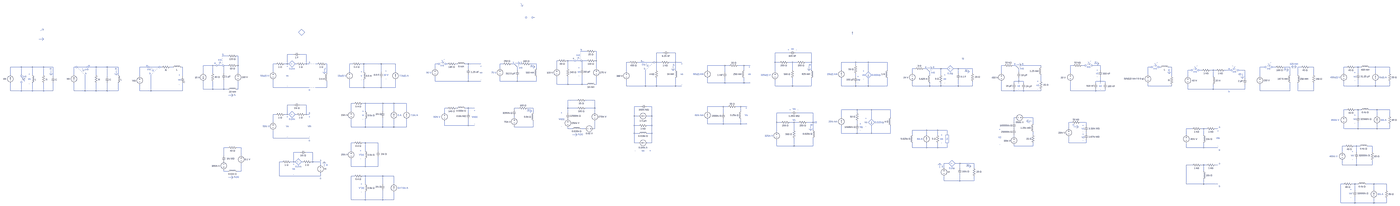
[diagram p0: schematic ELE226-3.asc, whole sheet]
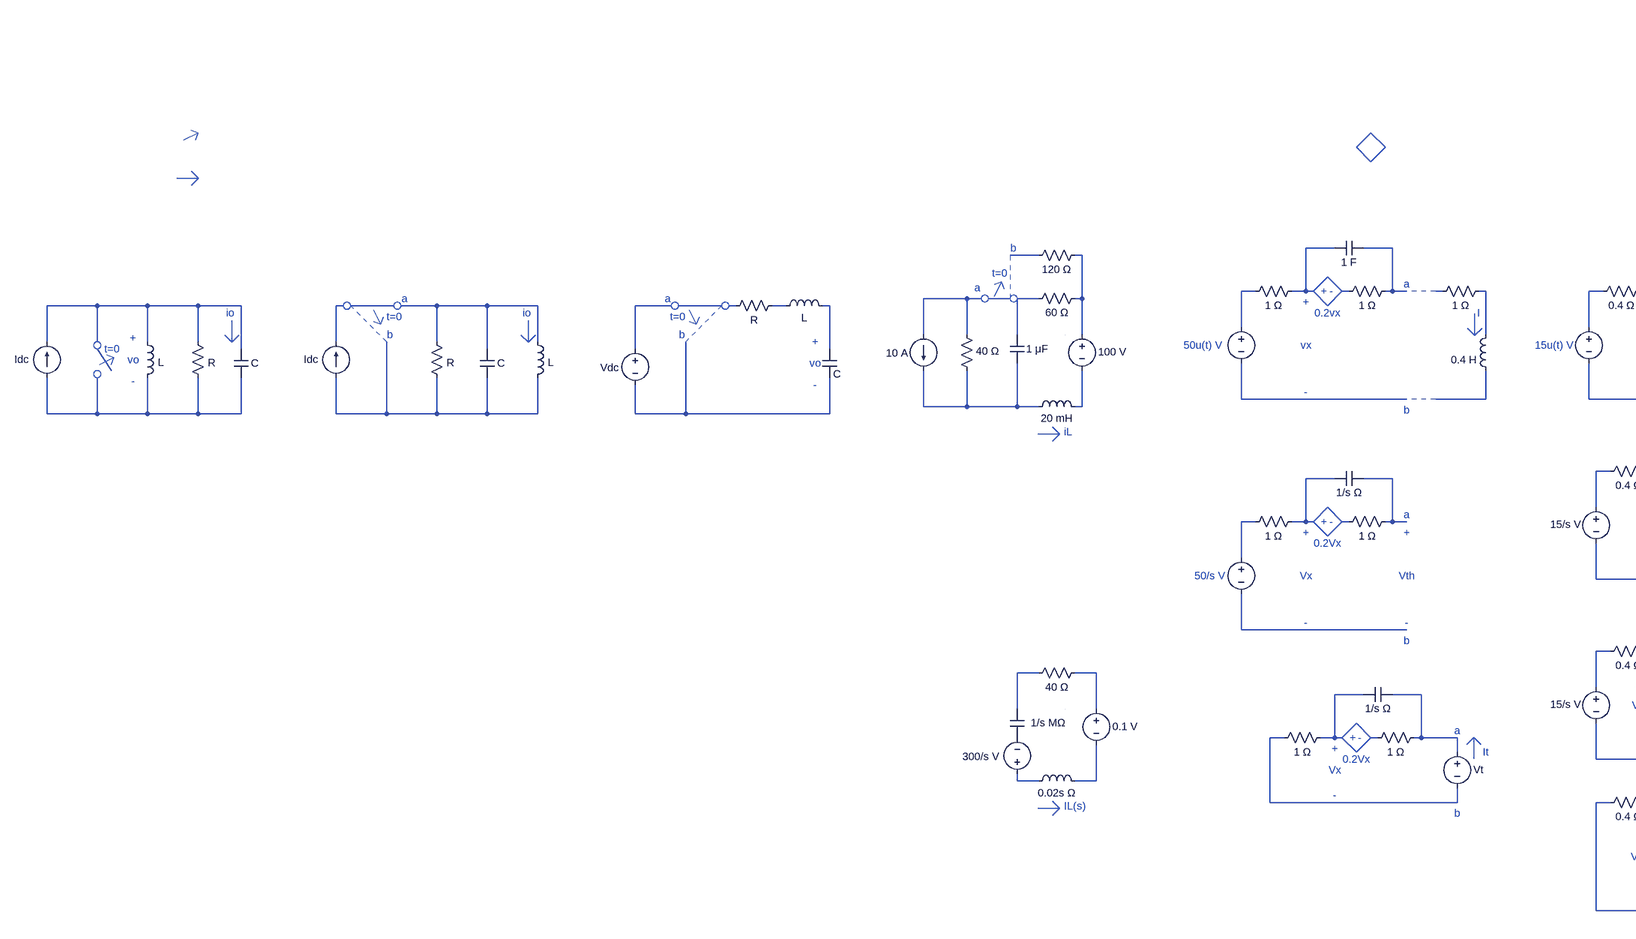
[diagram p1: schematic ELE226-3.asc, part, row 1 of 1, column 1 of 4]
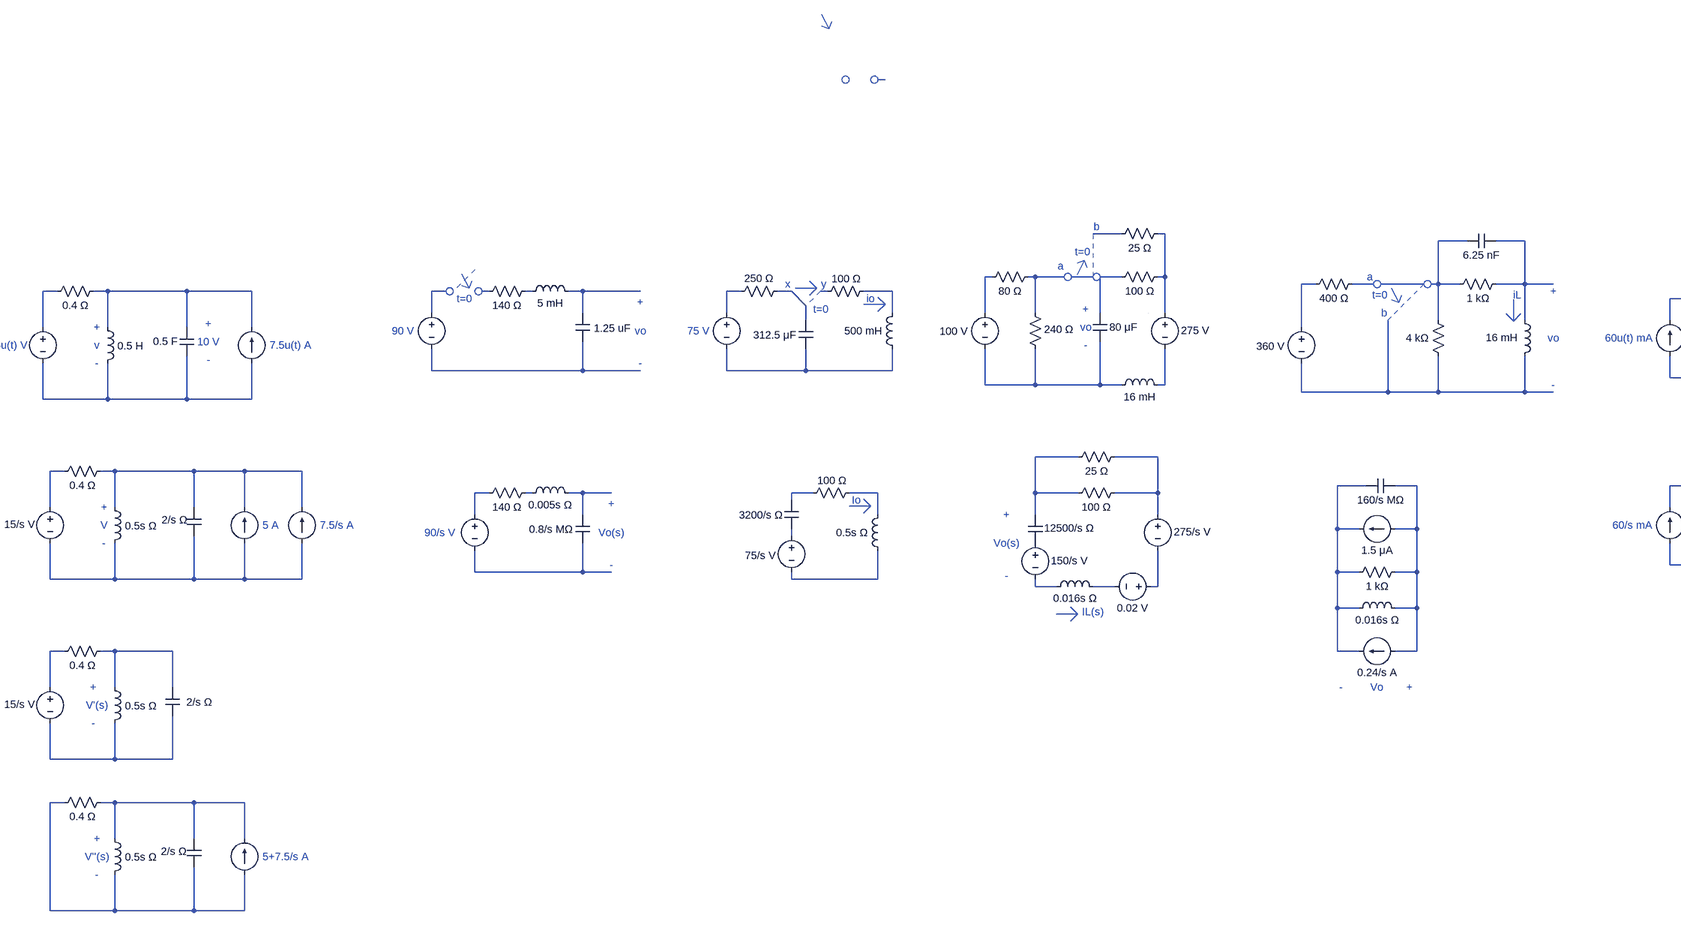
[diagram p2: schematic ELE226-3.asc, part, row 1 of 1, column 2 of 4]
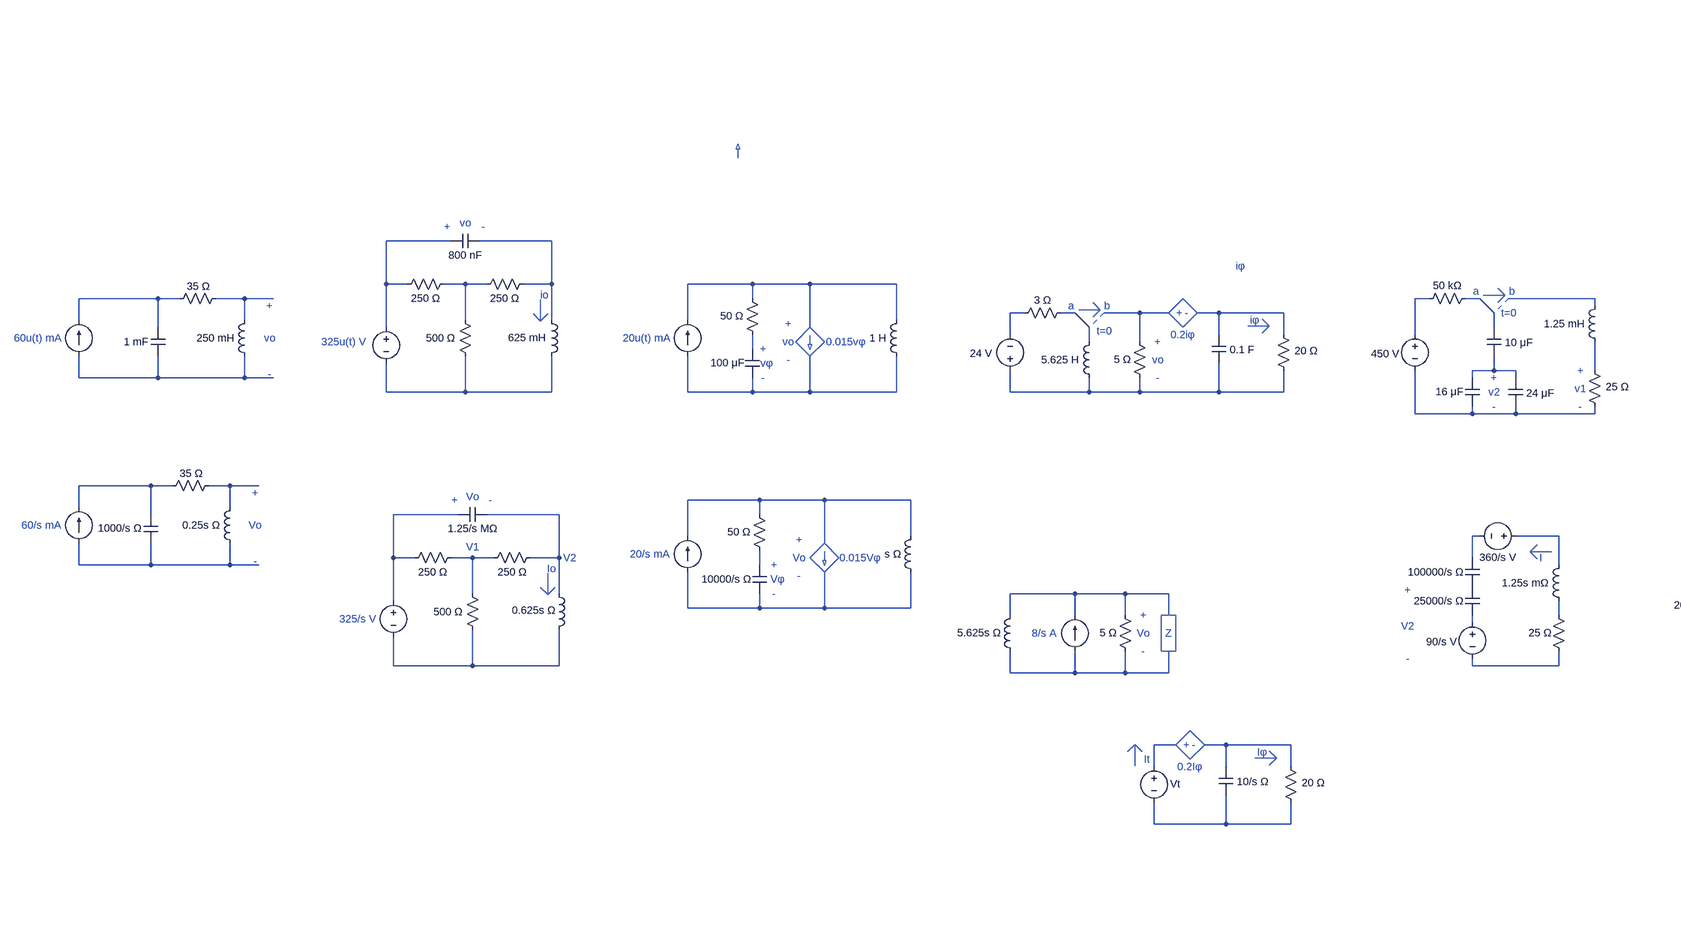
[diagram p3: schematic ELE226-3.asc, part, row 1 of 1, column 3 of 4]
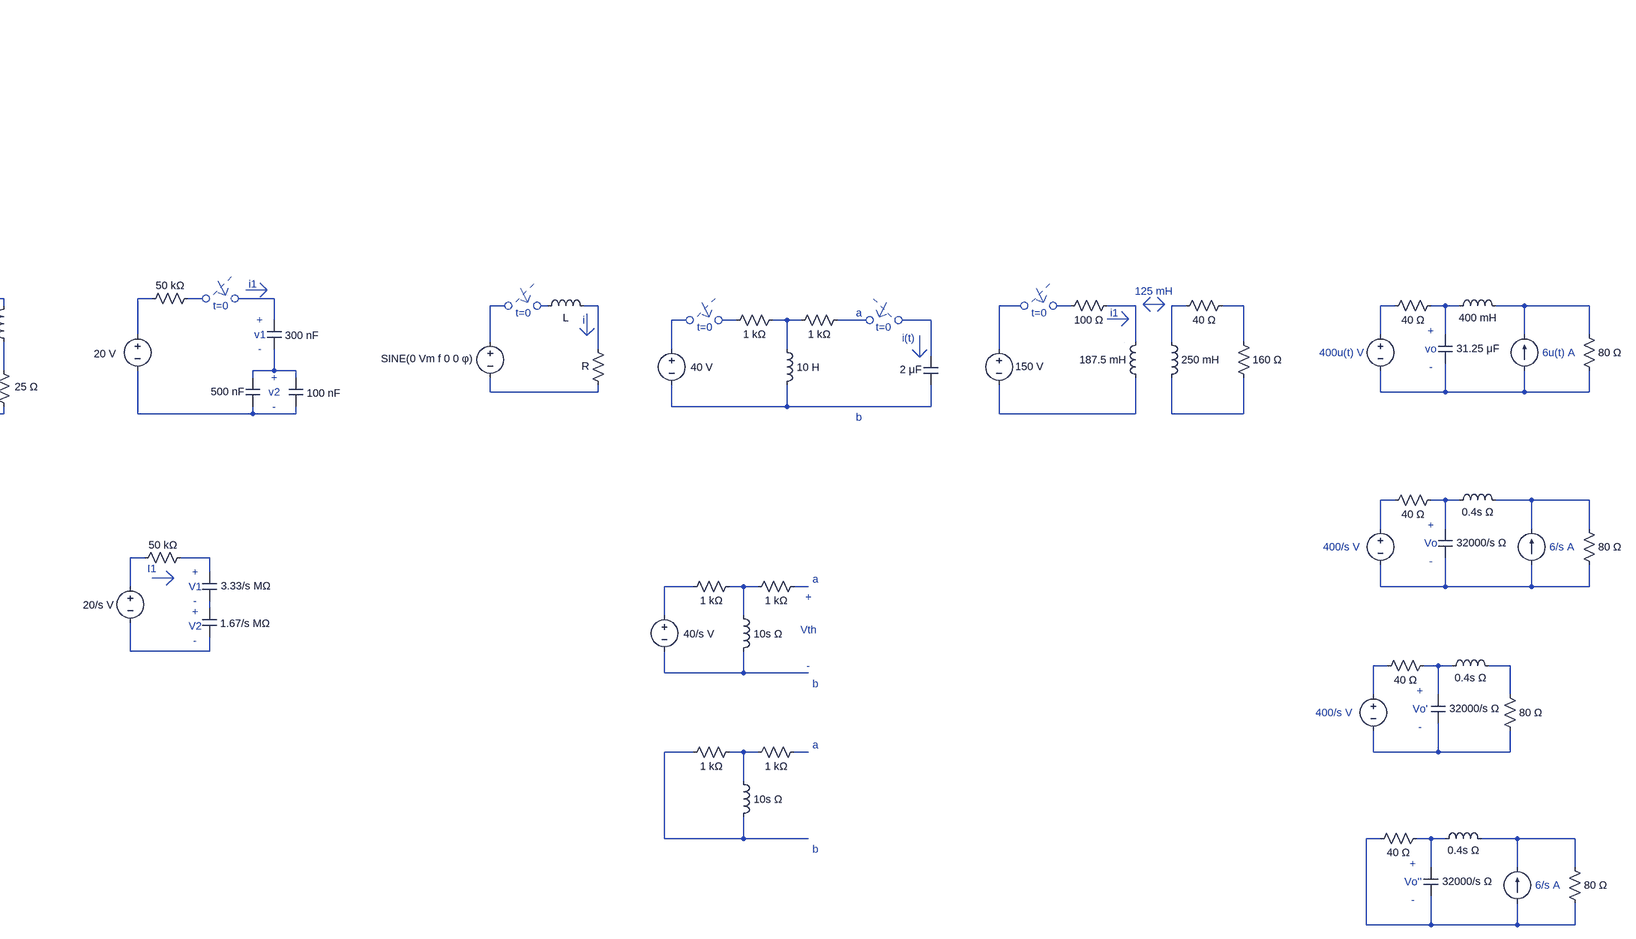
[diagram p4: schematic ELE226-3.asc, part, row 1 of 1, column 4 of 4]
* ELE226-3.asc
I1 N097 N046 Idc
L1 N046 N097 L
R1 N046 N097 R
C1 N046 N097 C
I2 N098 N047 Idc
L2 N049 N098 L
R2 N049 N098 R
C2 N049 N098 C
V1 N050 N099 Vdc
R3 N053 N052 R
L3 N053 N054 L
C3 N054 N099 C
I3 N035 N094 10 A
R5 N035 N094 40 Ω
C5 N094 N037 1 μF
R6 N011 N010 120 Ω
R7 N011 N037 60 Ω
V2 N011 N095 100 V
L4 N094 N095 20 mH
V3 N021 N091 50\u(t)
R4 N008 N021 1 Ω
C6 N008 N009 1 F
R8 N009 N022 1 Ω
R9 N024 N023 1 Ω
L5 N092 N024 0.4 H
V4 N025 N093 50\u(t)
R10 N026 N025 0.4 Ω
C4 N026 N093 0.5 F
L6 N026 N093 0.5 H
I4 N093 N026 Idc
V5 N027 N077 50\u(t)
R11 N029 N028 140 Ω
C7 N030 N077 1.25 uF
L7 N029 N030 5 mH
V6 N031 N078 50\u(t)
R12 N032 N031 250 Ω
L8 N078 N034 500 mH
C9 N032 N078 312.5 μF
R13 N033 N034 100 Ω
R16 N013 N083 240 Ω
C10 N083 N015 80 μF
R17 N003 N002 25 Ω
R18 N003 N015 100 Ω
V8 N003 N084 275 V
L10 N083 N084 16 mH
V7 N012 N083 100 V
R14 N013 N012 80 Ω
V11 N016 N085 360 V
C11 N005 N004 6.25 nF
R15 N017 N016 400 Ω
R19 N085 N004 4 kΩ
R20 N004 N005 1 kΩ
L9 N005 N085 16 mH
L11 N082 N039 250 mH
C8 N038 N082 1 mF
R22 N038 N039 35 Ω
I5 N082 N038 Idc
V9 N006 N086 325µ(t) V
C12 N007 N006 800 nF
R21 N019 N006 250 Ω
R23 N086 N019 500 Ω
R24 N019 N007 250 Ω
L12 N007 N086 625 mH
L13 N087 N020 1 H
C13 N075 N087 100 μF
R25 N075 N020 50 Ω
I6 N087 N020 Idc
V10 N088 N066 24 V
R26 N067 N066 3 Ω
L14 N088 N067 5.625 H
C14 N069 N088 0.1 F
R28 N088 N068 5 Ω
R27 N069 N088 20 Ω
V12 N040 N100 450 V
R29 N041 N040 50 kΩ
L15 N080 N042 1.25 mH
R31 N080 N100 25 Ω
C16 N041 N079 10 μF
C17 N079 N100 16 μF
C15 N079 N100 24 μF
V13 N043 N101 20 V
R30 N044 N043 50 kΩ
C18 N045 N081 300 nF
C19 N081 N101 500 nF
C20 N081 N101 100 nF
V14 N055 N089 SINE(0 Vm f 0 0 φ)
R33 N057 N089 R
L16 N056 N057 L
R32 N072 N071 1 kΩ
L17 N072 N096 10 H
R34 N073 N072 1 kΩ
C21 N074 N096 2 μF
V16 N070 N096 40 V
R37 N059 N060 100 Ω
V17 N058 N102 150 V
L19 N102 N060 187.5 mH
L18 N061 N103 250 mH
R35 N061 N062 40 Ω
R36 N062 N103 160 Ω
V15 N063 N090 50\u(t)
R38 N064 N063 40 Ω
C22 N064 N090 31.25 μF
L20 N064 N065 400 mH
I7 N090 N065 Idc
R39 N065 N090 80 Ω
C23 P001 N159 1/s MΩ
R41 N160 N159 40 Ω
V18 N160 N175 0.1 V
L21 N174 N175 0.02s Ω
V19 N174 P001 300/s V
V20 N125 N150 50\u(t)
R40 N108 N125 1 Ω
C24 N108 N109 1/s Ω
R42 N109 N126 1 Ω
R43 N163 N165 1 Ω
C25 N163 N164 1/s Ω
R44 N164 N166 1 Ω
V22 N164 N165 Vt
R45 N107 N106 0.4 Ω
C26 N107 N136 2/s Ω
L22 N107 N136 0.5s Ω
I8 N136 N107 Idc
V23 N106 N136 15/s V
I9 N136 N107 Idc
R46 N152 N151 0.4 Ω
C27 N152 N173 2/s Ω
L23 N152 N173 0.5s Ω
V21 N151 N173 15/s V
R47 N177 N176 0.4 Ω
C28 N177 N176 2/s Ω
L24 N177 N176 0.5s Ω
I11 N176 N177 Idc
V24 N114 N135 50\u(t)
R48 N115 N114 140 Ω
C29 N116 N135 0.8/s MΩ
L25 N115 N116 0.005s Ω
L26 N137 N118 0.5s Ω
C30 N117 N127 3200/s Ω
R49 N117 N118 100 Ω
V25 N127 N137 75/s V
C32 P002 N104 12500/s Ω
R50 N105 N104 100 Ω
V27 N105 N140 275/s V
L28 N138 N139 0.016s Ω
V28 P002 N138 150/s V
V26 N140 N139 0.02 V
R51 N105 N104 25 Ω
C31 N111 N110 160/s MΩ
I12 N111 N110 1.5 μA
R52 N111 N110 1 kΩ
L27 N110 N111 0.016s Ω
I13 N111 N110 0.24/s A
L29 N133 N113 0.25s Ω
C33 N112 N133 1000/s Ω
R53 N112 N113 35 Ω
I14 N133 N112 Idc
V29 N123 N154 325µ(t) V
C34 N124 N123 1.25/s MΩ
R54 N130 N123 250 Ω
R55 N154 N130 500 Ω
R56 N130 N124 250 Ω
L30 N124 N154 0.625s Ω
L31 N146 N119 s Ω
C35 N134 N146 10000/s Ω
R57 N134 N119 50 Ω
I15 N146 N119 Idc
C36 N168 N178 10/s Ω
R59 N161 N145 5 Ω
R60 N168 N178 20 Ω
I16 N161 N145 Idc
L33 N161 N145 5.625s Ω
V31 N167 N178 Vt
C37 P003 N149 25000/s Ω
V30 N149 N155 90/s V
C38 N128 P003 100000/s Ω
L34 N148 N129 1.25s mΩ
V32 N129 N128 360/s V
R58 N148 N155 25 Ω
V33 N131 N153 20/s V
R61 N132 N131 50 kΩ
C40 N132 N147 3.33/s MΩ
C41 N147 N153 1.67/s MΩ
R62 N142 N141 1 kΩ
L32 N142 N162 10s Ω
R63 N143 N142 1 kΩ
V34 N141 N162 40/s V
R64 N170 N169 1 kΩ
L35 N170 N169 10s Ω
R65 N171 N170 1 kΩ
V35 N120 N144 50\u(t)
R66 N121 N120 40 Ω
C39 N121 N144 32000/s Ω
L36 N121 N122 0.4s Ω
I17 N144 N122 Idc
R67 N122 N144 80 Ω
V36 N156 N172 50\u(t)
R68 N157 N156 40 Ω
C42 N157 N172 32000/s Ω
L37 N157 N158 0.4s Ω
R69 N158 N172 80 Ω
R70 N180 N179 40 Ω
C43 N180 N179 32000/s Ω
L38 N180 N181 0.4s Ω
I18 N179 N181 Idc
R71 N181 N179 80 Ω
* -
* +
* vo
* io
* t=0
* io
* t=0
* a
* b
* t=0
* b
* a
* -
* +
* vo
* t=0
* b
* a
* iL
* +
* vx
* -
* +
* -
* 0.2vx
* a
* b
* I
* 50u(t) V
* +
* v
* -
* 15u(t) V
* 10 V
* -
* +
* 7.5u(t) A
* 90 V
* -
* +
* vo
* t=0
* 75 V
* t=0
* x
* y
* io
* t=0
* b
* a
* +
* vo
* -
* t=0
* b
* a
* -
* +
* vo
* iL
* 60u(t) mA
* -
* +
* vo
* io
* 325u(t) V
* +
* -
* vo
* 20u(t) mA
* vφ
* -
* +
* 0.015vφ
* vo
* -
* +
* t=0
* a
* b
* iφ
* vo
* -
* +
* +
* -
* 0.2iφ
* t=0
* a
* b
* v1
* -
* +
* v2
* -
* +
* v2
* -
* +
* t=0
* v1
* -
* +
* i1
* t=0
* i
* t=0
* a
* b
* t=0
* i(t)
* t=0
* iφ
* i1
* 125 mH
* +
* vo
* -
* 400u(t) V
* 6u(t) A
* IL(s)
* +
* Vx
* -
* +
* -
* 0.2Vx
* a
* b
* 50/s V
* +
* Vth
* -
* +
* Vx
* -
* +
* -
* 0.2Vx
* a
* b
* It
* +
* V
* -
* 7.5/s A
* 5 A
* +
* V'(s)
* -
* +
* V''(s)
* -
* 5+7.5/s A
* 90/s V
* -
* +
* Vo(s)
* Io
* IL(s)
* -
* +
* Vo(s)
* +
* Vo
* -
* 60/s mA
* -
* +
* Vo
* Io
* 325/s V
* +
* -
* Vo
* V1
* V2
* 20/s mA
* Vφ
* -
* +
* 0.015Vφ
* Vo
* -
* +
* Iφ
* Vo
* -
* +
* +
* -
* 0.2Iφ
* Z
* 8/s A
* It
* I
* V2
* -
* +
* I1
* V2
* -
* +
* -
* +
* V1
* b
* a
* +
* Vth
* -
* b
* a
* +
* Vo
* -
* 400/s V
* 6/s A
* +
* Vo'
* -
* 400/s V
* +
* Vo''
* -
* 6/s A
.backanno
.end